# Altium schematic sheet F103 LCD1602+PCF8574 SRF05.SchDoc
size A4
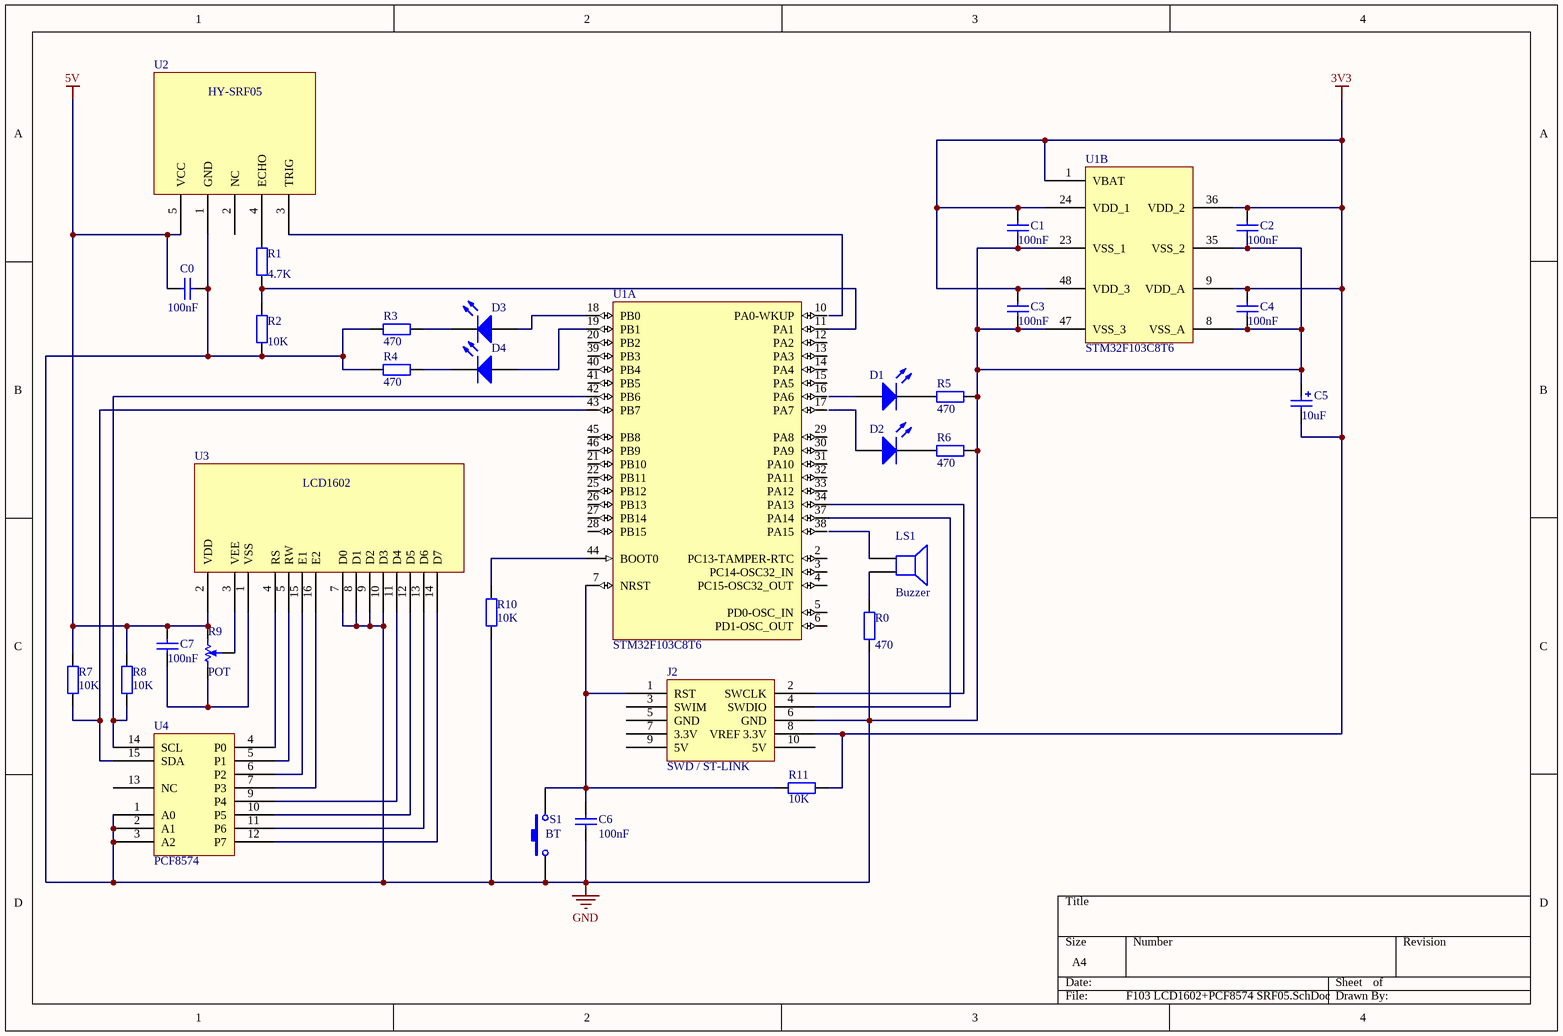
[diagram p0: F103 LCD1602+PCF8574 SRF05.SchDoc]

## Parts
C0  value 100nF  [C1206]
C1  value 100nF  [C1206]
C2  value 100nF  [C1206]
C3  value 100nF  [C1206]
C4  value 100nF  [C1206]
C5  (no value)  [POLAR0.8]
C6  value 100nF  [C1206]
C7  value 100nF  [C1206]
D1  (no value)  [LED-0]
D2  (no value)  [LED-0]
D3  (no value)  [LED-0]
D4  (no value)  [LED-0]
J2  SWD / ST-LINK
LS1  Buzzer  [PIN2]
R0  value 470  [AXIAL-0.4]
R1  value 4.7K  [AXIAL-0.4]
R2  value 10K  [AXIAL-0.4]
R3  value 470  [AXIAL-0.4]
R4  value 470  [AXIAL-0.4]
R5  value 470  [AXIAL-0.4]
R6  value 470  [AXIAL-0.4]
R7  10K  [AXIAL-0.4]
R8  10K  [AXIAL-0.4]
R9  POT  [POT4MM-2]
R10  10K  [AXIAL-0.4]
R11  10K  [AXIAL-0.4]
S1  BT  [SPST-2]
U1  STM32F103C8T6  [STM-LQFP48_N]  (part A of 2)
U1B  STM32F103C8T6
U2  HY-SRF05
U3  LCD1602
U4  PCF8574

## Nets
3V3: C1.2 C2.2 C3.2 C4.2 C5.2 J2.8(VREF_3.3V) R11.2 U1B.1(VBAT) U1B.9(VDD_A) U1B.24(VDD_1) U1B.36(VDD_2) U1B.48(VDD_3)
5V: C0.1 C7.2 R7.2 R8.2 R9.CW(+) U2.5(VCC) U3.2(VDD)
GND: C0.2 C1.1 C2.1 C3.1 C4.1 C5.1 C6.2 J2.6(GND) R0.1 R2.1 R3.1 R4.1 R5.2 R6.2 R10.2 S1.1 U1B.8(VSS_A) U1B.23(VSS_1) U1B.35(VSS_2) U1B.47(VSS_3) U2.1(GND) U3.7(D0) U3.8(D1) U3.9(D2) U3.10(D3) U4.1(A0) U4.2(A1) U4.3(A2)
NetC6_1: C6.1 J2.1(RST) R11.1 S1.2 U1.7(NRST)
NetC7_1: C7.1 R9.CCW(-) U3.1(VSS)
NetD1_1: D1.1(A) U1.16(PA6)
NetD1_2: D1.2(K) R5.1
NetD2_1: D2.1(A) U1.17(PA7)
NetD2_2: D2.2(K) R6.1
NetD3_1: D3.1(A) U1.18(PB0)
NetD3_2: D3.2(K) R3.2
NetD4_1: D4.1(A) U1.19(PB1)
NetD4_2: D4.2(K) R4.2
NetJ2_2: J2.2(SWCLK) U1.34(PA13)
NetJ2_4: J2.4(SWDIO) U1.37(PA14)
NetLS1_1: LS1.1 U1.38(PA15)
NetLS1_2: LS1.2 R0.2
NetR1_1: R1.1 R2.2 U1.11(PA1)
NetR1_2: R1.2 U2.4(ECHO)
NetR7_1: R7.1 U1.43(PB7) U4.15(SDA)
NetR8_1: R8.1 U1.42(PB6) U4.14(SCL)
NetR9_W: R9.W U3.3(VEE)
NetR10_1: R10.1 U1.44(BOOT0)
NetU1_10: U1.10(PA0-WKUP) U2.3(TRIG)
NetU3_4: U3.4(RS) U4.4(P0)
NetU3_5: U3.5(RW) U4.5(P1)
NetU3_11: U3.11(D4) U4.9(P4)
NetU3_12: U3.12(D5) U4.10(P5)
NetU3_13: U3.13(D6) U4.11(P6)
NetU3_14: U3.14(D7) U4.12(P7)
NetU3_15: U3.15(E1) U4.6(P2)
NetU3_16: U3.16(E2) U4.7(P3)

Not connected (* = marked no-connect by the designer): J2 3(SWIM) 5(GND) 7(3.3V) 9(5V) 10(5V); U1 2(PC13-TAMPER-RTC)* 3(PC14-OSC32_IN)* 4(PC15-OSC32_OUT)* 5(PD0-OSC_IN)* 6(PD1-OSC_OUT)* 12(PA2)* 13(PA3)* 14(PA4)* 15(PA5)* 20(PB2)* 21(PB10)* 22(PB11)* 25(PB12)* 26(PB13)* 27(PB14)* 28(PB15)* 29(PA8)* 30(PA9)* 31(PA10)* 32(PA11)* 33(PA12)* 39(PB3)* 40(PB4)* 41(PB5)* 45(PB8)* 46(PB9)*; U2 2(NC); U4 13(NC)

## Notes on the sheet
- (in symbol Cap Pol2) 10uF

## Library data of the parts
C0-C4 C6 C7 = Cap Semi: Capacitor (Semiconductor SIM Model); Published: 8-Jun-2000; LatestRevisionDate: 29-May-2009; LatestRevisionNote: IPC-7351 Footprint Added.; PackageReference: C1206; Publisher: Altium Limited; PackageDescription: Chip Capacitor
C5 = Cap Pol2: Polarized Capacitor (Axial); Published: 8-Jun-2000; LatestRevisionDate: 17-Jul-2002; LatestRevisionNote: Re-released for DXP Platform.; PackageReference: POLAR0.8; Publisher: Altium Limited; PackageDescription: Polarized Capacitor; 2 Leads
D1-D4 = LED0: Typical INFRARED GaAs LED; Published: 8-Jun-2000; LatestRevisionDate: 08-Jul-2005; LatestRevisionNote: Mech Layer 1 removed.; PackageReference: LED-0; Publisher: Altium Limited; PackageDescription: LED; 2 Leads
J2 = Header 5X2H
LS1 = Speaker: Loudspeaker; Published: 24-Mar-1999; LatestRevisionDate: 17-Jul-2002; LatestRevisionNote: Re-released for DXP Platform.; PackageReference: PIN2; Publisher: Altium Limited
R0-R6 = Res2: Resistor; Published: 8-Jun-2000; LatestRevisionDate: 17-Jul-2002; LatestRevisionNote: Re-released for DXP Platform.; PackageReference: AXIAL-0.4; Publisher: Altium Limited; PackageDescription: Axial Device, Thru-Hole; 2 Leads; 0.4 in Pin Spacing
R7 R8 R10 R11 = Res2: Published: 8-Jun-2000; LatestRevisionDate: 17-Jul-2002; LatestRevisionNote: Re-released for DXP Platform.; PackageReference: AXIAL-0.4; Publisher: Altium Limited; PackageDescription: Axial Device, Thru-Hole; 2 Leads; 0.4 in Pin Spacing
R9 = RPot SM: Square Trimming Potentiometer; Published: 17-Dec-2003; DatasheetVersion: Oct-2003; PackageReference: POT4MM-2; Publisher: Altium Limited; PackageDescription: Square Trimming Potentiometer; ComponentLink1Description: Manufacturer Link; ComponentLink1URL: http://bourns.com/2/search.html
S1 = SW-PB: Switch; Published: 24-Mar-1999; LatestRevisionDate: 17-Jul-2002; LatestRevisionNote: Re-released for DXP Platform.; PackageReference: SPST-2; Publisher: Altium Limited; PackageDescription: Switch; 2 Leads
U1 = STM32F103C8T6: ARM Cortex-M3 32-bit MCU, 64 KB Flash, 20 KB Internal RAM, 37 I/Os, 48-pin LQFP, -40 to 85 degC, Tray; A/D Converter: 2x12-bit (10 Channel); FLASH Size (Prog) (kB): 64; I/Os (High Current): 37; Internal RAM Size (kB): 20; Operating Frequency(F) (Processor speed) (MHz): 72; Supply Voltage(Vcc) min (V): 2; DatasheetVersion: Rev. 16; PackageVersion: Rev. 6, 06/2013; PackageReference: LQFP48; PackageDescription: 48-Pin Low Profile Quad Flat Package, 7 x 7 mm Body, 0.5 mm Pitch; Supplier 1: Digi-Key; Supplier Part Number 1: 497-6063-ND; Supplier 2: Farnell; Supplier Part Number 2: 1447637; Supplier 3: Newark; Supplier Part Number 3: 59M2182; Supplier 4: Newark; Supplier Part Number 4: 57P1222; Supplier 5: Mouser; Supplier Part Number 5: 511-STM32F103C8T6; Core: ARM Cortex-M3; Packing: Tray; Mounting Technology: Surface Mount; PartNumber: STM32F103C8T6; ComponentLink1Description: Manufacturer URL; ComponentLink1URL: http://www.st.com/web/en/home.html; ComponentLink2Description: Datasheet; ComponentLink2URL: http://www.st.com/st-web-ui/static/active/en/resource/technical/document/datasheet/CD00161566.pdf; ComponentLink3Description: Package Specification; ComponentLink3URL: http://www.st.com/st-web-ui/static/active/en/resource/technical/document/datasheet/DM00058181.pdf
U1B U2-U4 = Component_1